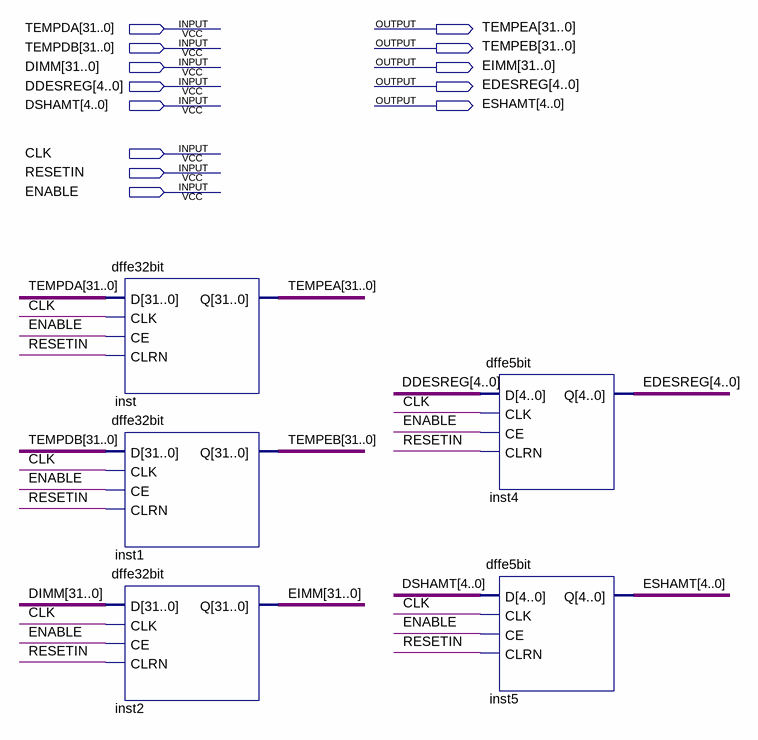
[diagram p0: schematic sheet]
// Quartus schematic ID-EXE-INSTDATA-BUFFER.bdf as structural Verilog: 5 symbols, 13 pins
module \ID-EXE-INSTDATA-BUFFER  (
  input  [31:0] TEMPDA,
  input  [31:0] TEMPDB,
  input  [31:0] DIMM,
  input  [4:0] DDESREG,
  input  [4:0] DSHAMT,
  input  CLK,
  input  RESETIN,
  input  ENABLE,
  output [31:0] TEMPEA,
  output [31:0] TEMPEB,
  output [31:0] EIMM,
  output [4:0] EDESREG,
  output [4:0] ESHAMT
);

  dffe32bit inst (.D(TEMPDA), .CLK(CLK), .CE(ENABLE), .CLRN(RESETIN), .Q(TEMPEA));
  dffe32bit inst1 (.D(TEMPDB), .CLK(CLK), .CE(ENABLE), .CLRN(RESETIN), .Q(TEMPEB));
  dffe32bit inst2 (.D(DIMM), .CLK(CLK), .CE(ENABLE), .CLRN(RESETIN), .Q(EIMM));
  dffe5bit inst4 (.D(DDESREG), .CLK(CLK), .CE(ENABLE), .CLRN(RESETIN), .Q(EDESREG));
  dffe5bit inst5 (.D(DSHAMT), .CLK(CLK), .CE(ENABLE), .CLRN(RESETIN), .Q(ESHAMT));
endmodule
